# EAGLE design Controller-Modul_v1 (EAGLE 8.5.0)
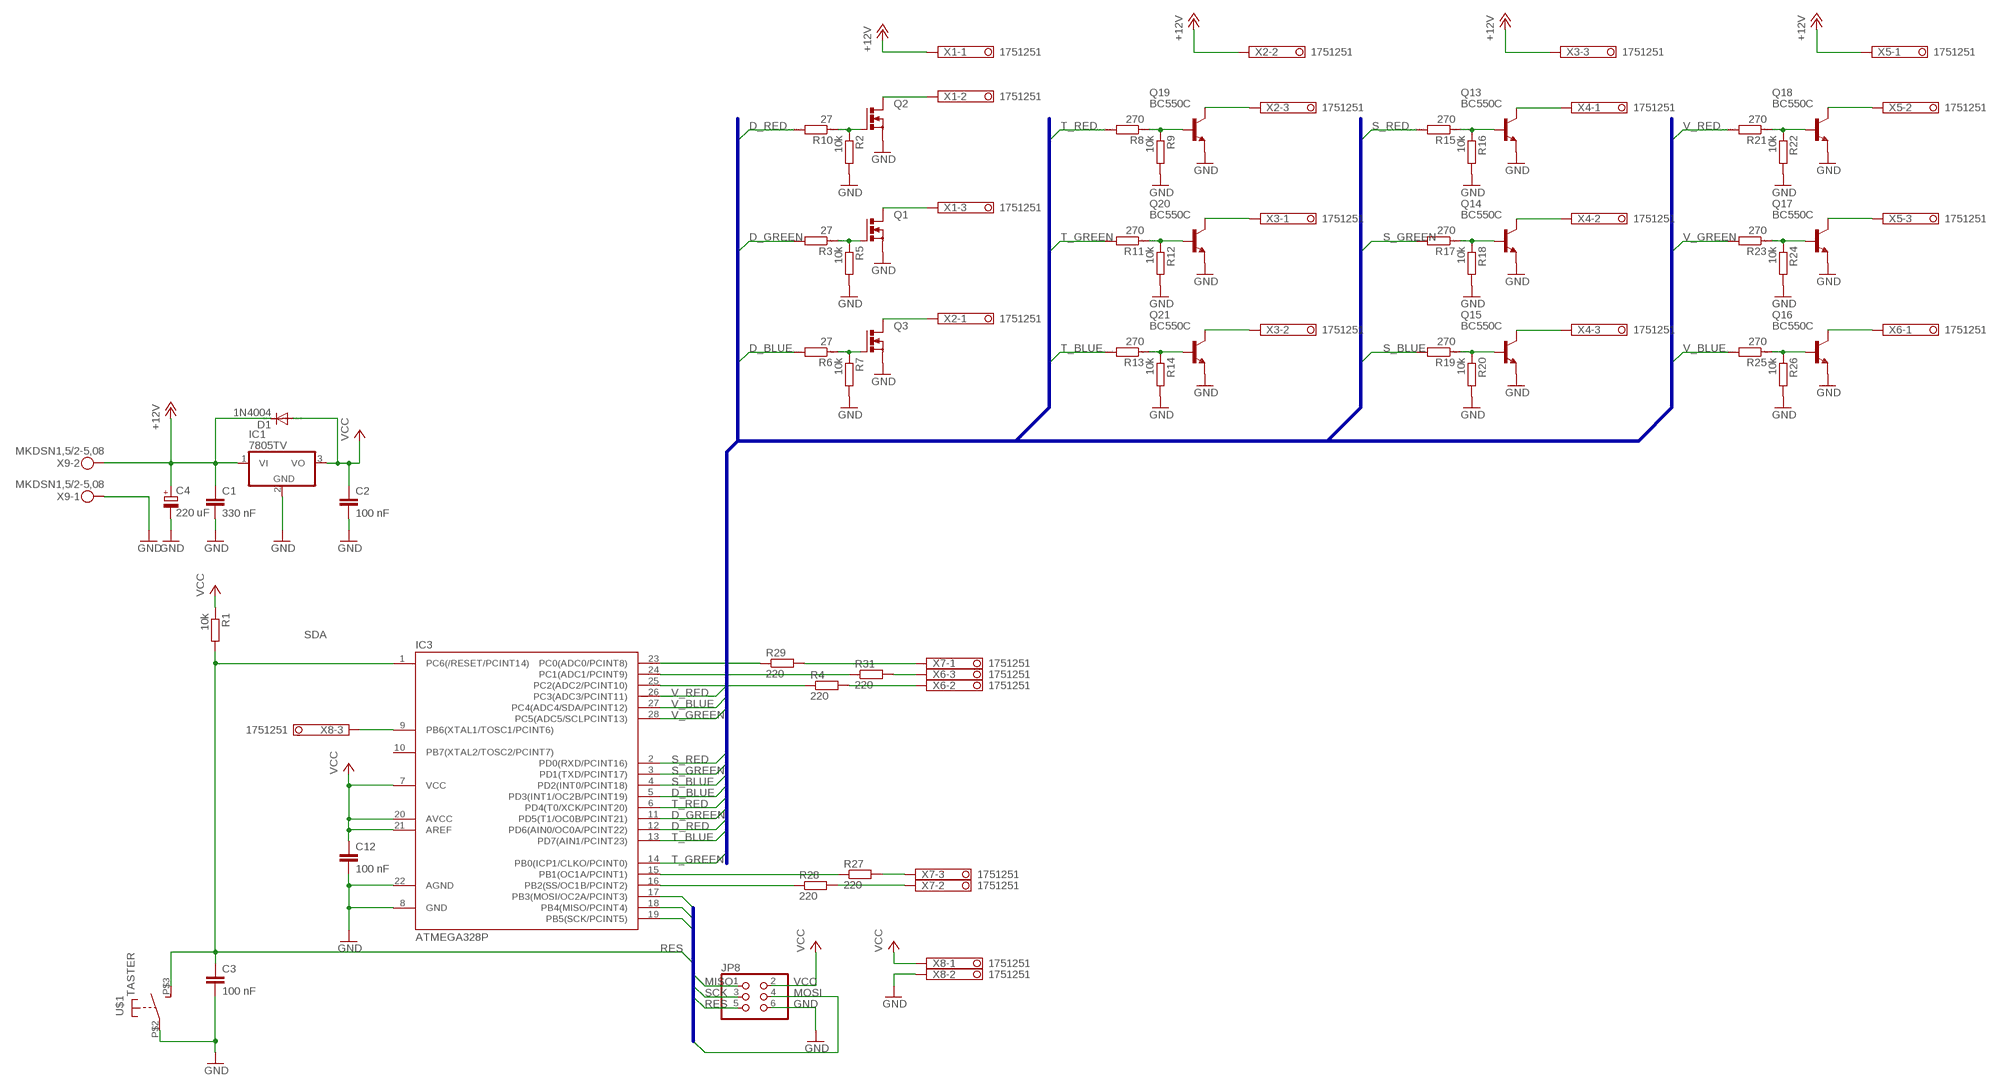
[diagram p0: schematic, sheet 1]

## Parts
C1  330 nF  C-EUC1206  [C1206]
C2  100 nF  C-EUC0603  [C0603]
C3  100 nF  C-EUC0603  [C0603]
C4  220 uF  CPOL-EUE3.5-8  [E3,5-8]
C12  100 nF  C-EUC0603  [C0603]
D1  1N4004  [DO41-10]
IC1  7805TV  [TO220V]
IC3  ATMEGA328P  MEGA48/88/168-PU  [DIL28-3]
JP8  PINHD-2X3  [2X03]
Q1  PMOSFET_NTO220BV  [TO220BV]
Q2  PMOSFET_NTO220BV  [TO220BV]
Q3  PMOSFET_NTO220BV  [TO220BV]
Q13  BC550C  [TO92-EBC]
Q14  BC550C  [TO92-EBC]
Q15  BC550C  [TO92-EBC]
Q16  BC550C  [TO92-EBC]
Q17  BC550C  [TO92-EBC]
Q18  BC550C  [TO92-EBC]
Q19  BC550C  [TO92-EBC]
Q20  BC550C  [TO92-EBC]
Q21  BC550C  [TO92-EBC]
R1  10k  R-EU_R1206  [R1206]
R2  10k  R-EU_R1206  [R1206]
R3  27  RR1206  [R1206]
R4  220  R-EU_R1206  [R1206]
R5  10k  R-EU_R1206  [R1206]
R6  27  RR1206  [R1206]
R7  10k  R-EU_R1206  [R1206]
R8  270  RR1206  [R1206]
R9  10k  R-EU_R1206  [R1206]
R10  27  RR1206  [R1206]
R11  270  RR1206  [R1206]
R12  10k  R-EU_R1206  [R1206]
R13  270  RR1206  [R1206]
R14  10k  R-EU_R1206  [R1206]
R15  270  RR1206  [R1206]
R16  10k  R-EU_R1206  [R1206]
R17  270  RR1206  [R1206]
R18  10k  R-EU_R1206  [R1206]
R19  270  RR1206  [R1206]
R20  10k  R-EU_R1206  [R1206]
R21  270  RR1206  [R1206]
R22  10k  R-EU_R1206  [R1206]
R23  270  RR1206  [R1206]
R24  10k  R-EU_R1206  [R1206]
R25  270  RR1206  [R1206]
R26  10k  R-EU_R1206  [R1206]
R27  220  R-EU_R1206  [R1206]
R28  220  R-EU_R1206  [R1206]
R29  220  R-EU_R1206  [R1206]
R31  220  R-EU_R1206  [R1206]
U$1  TASTER  [NAMAE-JTP-1130]
X1  1751251  [1751251]
X2  1751251  [1751251]
X3  1751251  [1751251]
X4  1751251  [1751251]
X5  1751251  [1751251]
X6  1751251  [1751251]
X7  1751251  [1751251]
X8  1751251  [1751251]
X9  MKDSN1,5/2-5,08  [MKDSN1,5/2-5,08]

## Nets
+12V: C1.1 C4.+ D1.C IC1.1(VI) X1.1 X2.2 X3.3 X5.1 X9.2
D_BLUE: IC3.5(PD3(INT1/OC2B/PCINT19)) R6.2
D_GREEN: IC3.11(PD5(T1/OC0B/PCINT21)) R3.2
D_RED: IC3.12(PD6(AIN0/OC0A/PCINT22)) R10.2
GND: C1.2 C2.2 C3.2 C4.- C12.2 IC1.2(GND) IC3.8(GND) IC3.22(AGND) JP8.6 Q1.S Q2.S Q3.S Q13.E Q14.E Q15.E Q16.E Q17.E Q18.E Q19.E Q20.E Q21.E R2.2 R5.2 R7.2 R9.2 R12.2 R14.2 R16.2 R18.2 R20.2 R22.2 R24.2 R26.2 U$1.P$2(P) X8.2 X9.1
MISO: IC3.18(PB4(MISO/PCINT4)) JP8.1
MOSI: IC3.17(PB3(MOSI/OC2A/PCINT3)) JP8.4
N$1: Q1.G R3.1 R5.1
N$2: Q3.G R6.1 R7.1
N$4: IC3.24(PC1(ADC1/PCINT9)) R31.1
N$5: Q19.B R8.1 R9.1
N$6: Q20.B R11.1 R12.1
N$7: Q2.G R2.1 R10.1
N$8: Q21.B R13.1 R14.1
N$9: Q13.B R15.1 R16.1
N$10: Q14.B R17.1 R18.1
N$11: Q15.B R19.1 R20.1
N$12: Q18.B R21.1 R22.1
N$13: Q17.B R23.1 R24.1
N$14: Q16.B R25.1 R26.1
N$15: Q2.D X1.2
N$17: Q19.C X2.3
N$18: Q1.D X1.3
N$19: Q3.D X2.1
N$20: Q20.C X3.1
N$21: Q21.C X3.2
N$22: Q18.C X5.2
N$23: Q17.C X5.3
N$24: Q16.C X6.1
N$25: Q15.C X4.3
N$26: Q14.C X4.2
N$27: Q13.C X4.1
N$28: IC3.25(PC2(ADC2/PCINT10)) R4.1
N$29: IC3.23(PC0(ADC0/PCINT8)) R29.1
N$30: IC3.15(PB1(OC1A/PCINT1)) R27.1
N$31: IC3.16(PB2(SS/OC1B/PCINT2)) R28.1
N$32: R31.2 X6.3
N$33: R4.2 X6.2
N$34: R27.2 X7.3
N$35: R29.2 X7.1
N$36: R28.2 X7.2
N$38: IC3.9(PB6(XTAL1/TOSC1/PCINT6)) X8.3
RES: C3.1 IC3.1(PC6(/RESET/PCINT14)) JP8.5 R1.2 U$1.P$3(S)
S_BLUE: IC3.4(PD2(INT0/PCINT18)) R19.2
S_GREEN: IC3.3(PD1(TXD/PCINT17)) R17.2
S_RED: IC3.2(PD0(RXD/PCINT16)) R15.2
SCK: IC3.19(PB5(SCK/PCINT5)) JP8.3
T_BLUE: IC3.13(PD7(AIN1/PCINT23)) R13.2
T_GREEN: IC3.14(PB0(ICP1/CLKO/PCINT0)) R11.2
T_RED: IC3.6(PD4(T0/XCK/PCINT20)) R8.2
V_BLUE: IC3.27(PC4(ADC4/SDA/PCINT12)) R25.2
V_GREEN: IC3.28(PC5(ADC5/SCLPCINT13)) R23.2
V_RED: IC3.26(PC3(ADC3/PCINT11)) R21.2
VCC: C2.1 C12.1 D1.A IC1.3(VO) IC3.7(VCC) IC3.20(AVCC) IC3.21(AREF) JP8.2 R1.1 X8.1
Unconnected: IC3.10(PB7(XTAL2/TOSC2/PCINT7))

## Buses
ISP:MISO,MOSI,SCK,RES
LED:D_RED,D_GREEN,D_BLUE,T_RED,T_GREEN,T_BLUE,S_RED,S_GREEN,S_BLUE,V_RED,V_GREEN,V_BLUE

## Notes on the sheet
- SDA

## Library data of the parts
C1-C3 C12 = resistor:C-EU: CAPACITOR, European symbol
C4 = rcl:CPOL-EU: POLARIZED CAPACITOR, European symbol
D1 = diode:1N4004: DIODE general purpose rectifier, 1 A
IC1 = linear:78*: Positive VOLTAGE REGULATOR Source: http://cache.national.com/ds/LM/LM78L05.pdf http://www.fairchildsemi.com/ds/LM/LM7805.pdf
IC3 = avr-6:MEGA48/88/168-PU
JP8 = pinhead:PINHD-2X3: PIN HEADER
Q1-Q3 = transistor-power:PMOSFET_N: Power MOSFET N-Channel
Q13-Q21 = transistor-npn:BC550*: NPN Transistor
R1 R2 R4 R5 R7 R9 R12 R14 R16 R18 R20 R22 R24 R26-R29 R31 = resistor:R-EU_: RESISTOR, European symbol
R3 R6 R8 R10 R11 R13 R15 R17 R19 R21 R23 R25 = eagle-ltspice:R: RESISTOR, European symbol; SPICEMODEL: NONE; SPICEPREFIX: R
U$1 = 0liver:TASTER
X1-X8 = con-phoenix-350:1751251: MKDS 1/ 3-3,5 Printklemme Nennstrom: 10 A Bemessungsspannung: 160 V Raster: 3,5 mm Polzahl: 3 Montageart: Löten Anschlussart: Schraubanschluss Anschlussrichtung vom Leiter zur Platine: 0° Source: http://eshop.phoenixcontact.com .. 1751251.pdf; OC_FARNELL: unknown; OC_NEWARK: unknown
X9 = con-phoenix-508:MKDSN1,5/2-5,08: MKDSN 1,5/ 2-5,08 Printklemme Nennstrom: 13,5 A Nennspannung: 250 V Rastermaß: 5,08 mm Polzahl: 2 Anschlussart: Schraubanschluss Montage: Löten Anschlussrichtung Leiter/Platine: 0 ° Artikelnummer: 1729128 Source: http://eshop.phoenixcontact.com .. 1729128.pdf

## Board
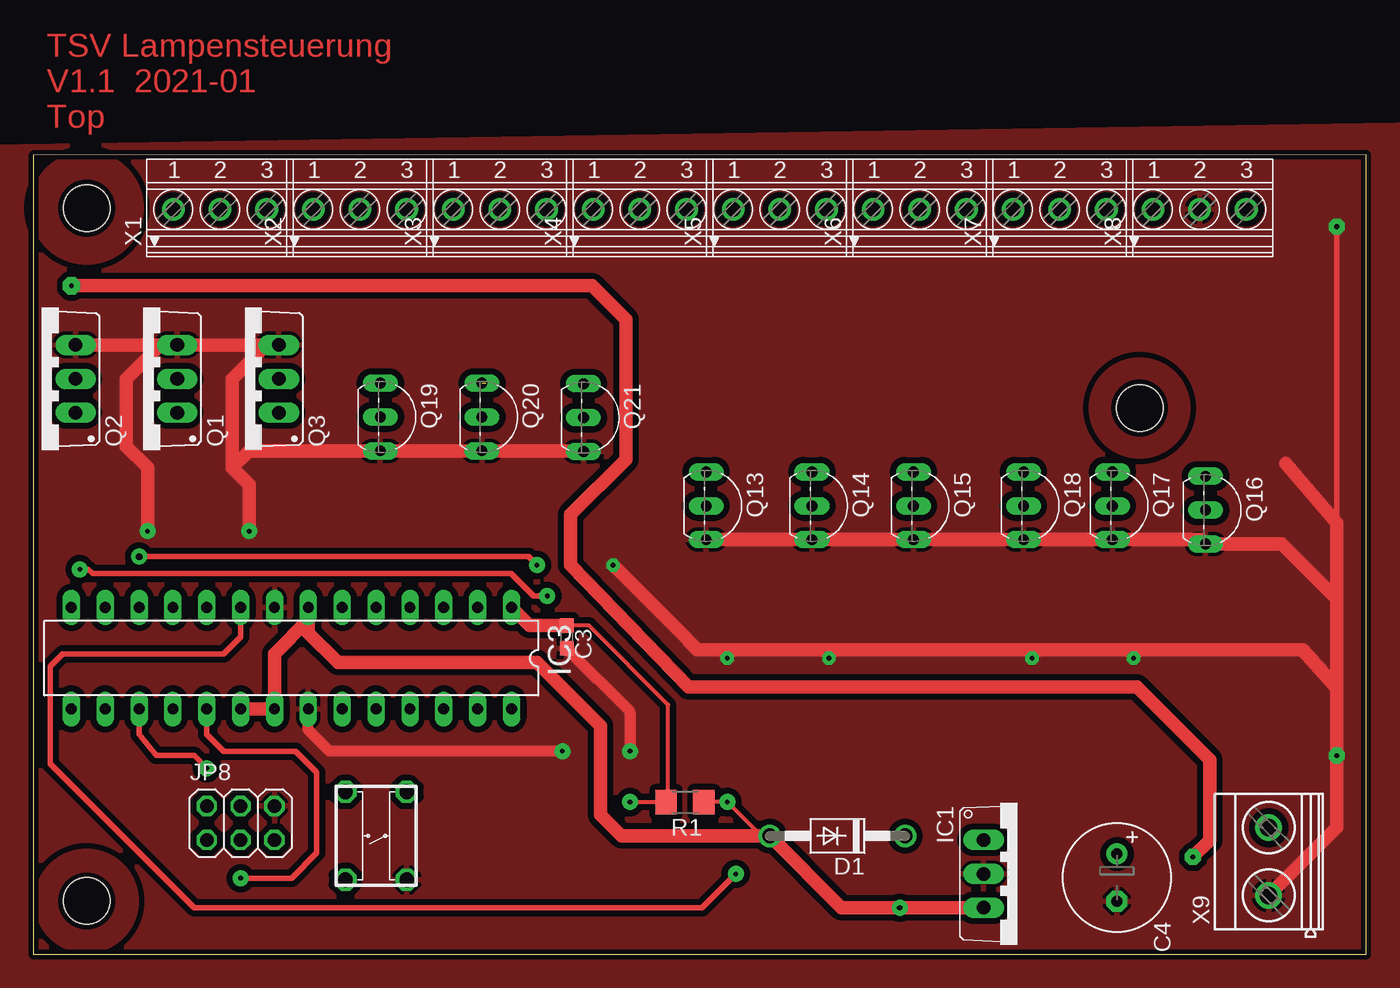
[diagram p1: board, top side]
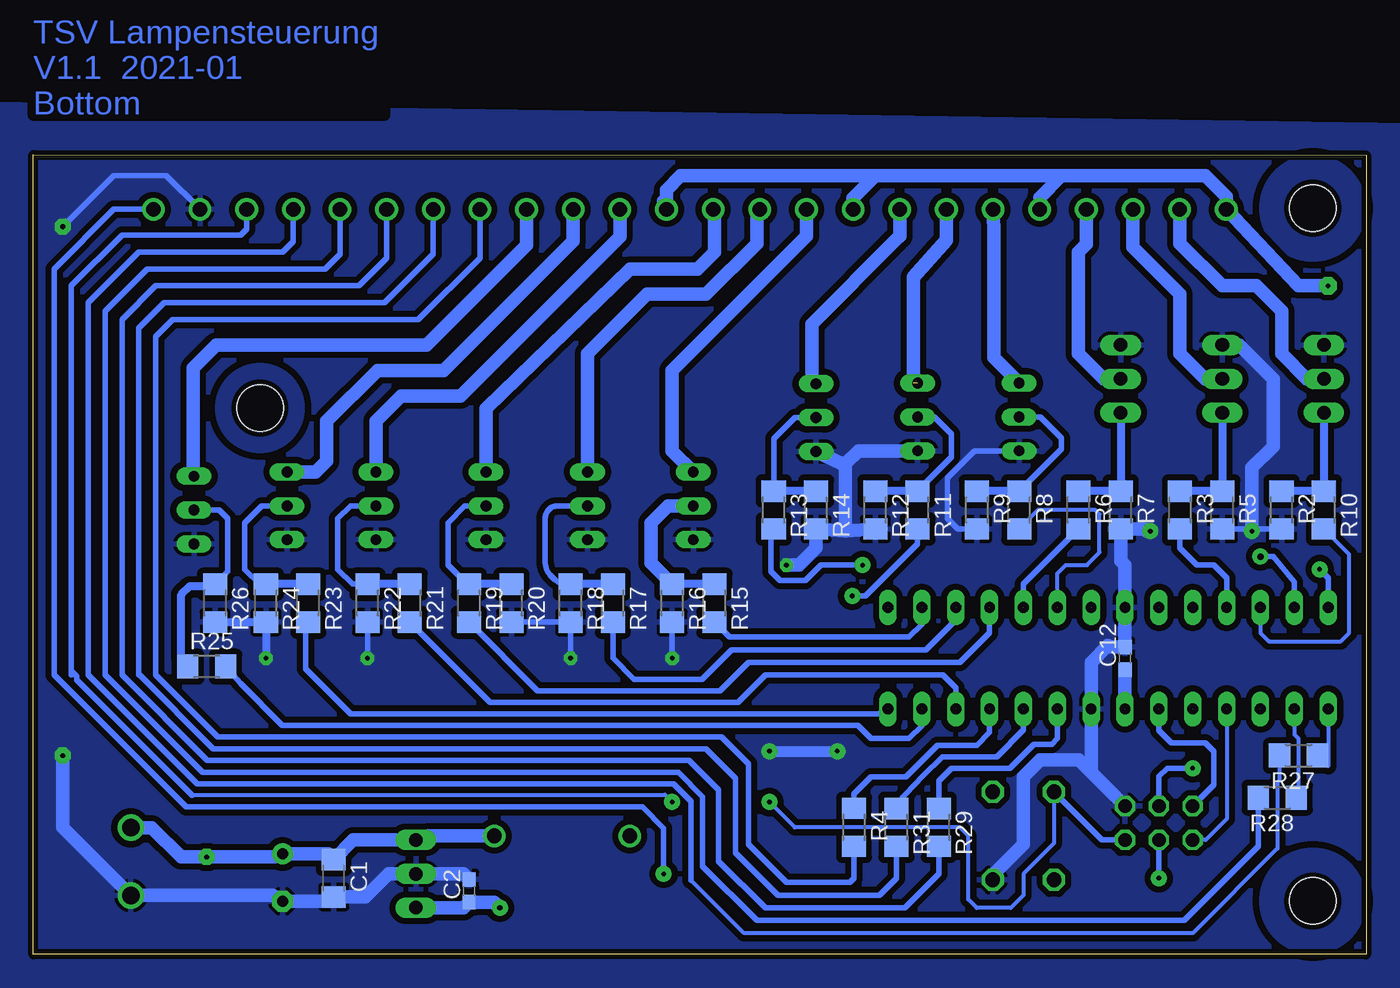
[diagram p2: board, bottom side, seen from below]

Size 100 x 60 mm. Coordinates in mm from the lower left corner, seen from the top.
Outline: 0,0 100,0 100,60 0,59.95 0,0
Copper layers (1*16): Top 0.035mm / dielectric 1.5mm / Bottom 0.035mm
Design rules "default *": minimum track width 10mil, minimum drill 24mil, track to track 18mil, track to pad 18mil, pad to pad 18mil, via to via 18mil, smd to smd 8mil, copper to edge 15mil, drill to drill 8mil, minimum pad ring 10mil, minimum via ring 8mil, stop-mask expansion 4mil, vias tented up to drill 0mil, thermal gap 10mil
Holes 3.5 mm at 4,56 4,4 83,41
tRestrict: area 79,37 to 87,45; area -0.5,51.5 to 8.5,60.5; area -0.1,-0.1 to 8.1,8.1
bRestrict: area -0.2,-0.2 to 8.2,8.2; area -0.2,51.8 to 8.2,60.2; area 79.4,37.4 to 86.6,44.6

### Footprints (pad centres in the part's own frame; a part is rotated, then mirrored left to right if it is on the bottom)
C1206 = smd 1.6 x 1.8: 1 -1.4,0; 2 1.4,0
C0603 = smd 1.1 x 1: 1 -0.85,0; 2 0.85,0
E3,5-8 = drill 0.813 pad 1.6: + -1.778,0 | drill 0.813 pad 1.6 octagon: - 1.778,0
DO41-10 = drill 1.118: A 5.08,0; C -5.08,0
TO220V = drill 1.016 long: 1 -2.54,-2.54; 2 0,-2.54; 3 2.54,-2.54
DIL28-3 = drill 0.813 long: 1 -16.51,-3.81; 2 -13.97,-3.81; 3 -11.43,-3.81; 4 -8.89,-3.81; 5 -6.35,-3.81; 6 -3.81,-3.81; 7 -1.27,-3.81; 8 1.27,-3.81; 9 3.81,-3.81; 10 6.35,-3.81; 11 8.89,-3.81; 12 11.43,-3.81; 13 13.97,-3.81; 14 16.51,-3.81; 15 16.51,3.81; 16 13.97,3.81; 17 11.43,3.81; 18 8.89,3.81; 19 6.35,3.81; 20 3.81,3.81; 21 1.27,3.81; 22 -1.27,3.81; 23 -3.81,3.81; 24 -6.35,3.81; 25 -8.89,3.81; 26 -11.43,3.81; 27 -13.97,3.81; 28 -16.51,3.81
2X03 = drill 1.016 octagon: 1 -2.54,-1.27; 2 -2.54,1.27; 3 0,-1.27; 4 0,1.27; 5 2.54,-1.27; 6 2.54,1.27
TO220BV = drill 1.016 long: D 0,-2.54; G -2.54,-2.54; S 2.54,-2.54
TO92-EBC = drill 0.813 long: B 0,-1.27; C -2.54,-1.27; E 2.54,-1.27
R1206 = smd 1.6 x 1.803: 1 -1.422,0; 2 1.422,0
NAMAE-JTP-1130 = drill 1.1 octagon: P$1 3.3,-2.3; P$2 -3.3,-2.3; P$3 3.3,2.3; P$4 -3.3,2.3
1751251 = drill 1.1 pad 1.7: 1 -3.5,-0.1; 2 0,-0.1; 3 3.5,-0.1
MKDSN1,5/2-5,08 = drill 1.3 pad 2: 1 -2.561,0.025; 2 2.519,0.025

### Placement (x,y rotation side)
C1  77.47,5.71 270 bottom
C2  67.3,4.77 90 bottom
C3  40.01,23.82 270 top
C4  81.3,5.76 270 top
C12  18.1,22.21 90 bottom
D1  60.33,8.88 180 top
IC1  73.83,6.04 270 top
IC3  19.36,22.22 180 top
JP8  15.55,9.86 0 top
Q1  8.26,43.18 90 top
Q2  0.64,43.18 90 top
Q3  15.88,43.18 90 top
Q13  51.75,33.66 270 top
Q14  59.69,33.66 270 top
Q15  67.31,33.66 270 top
Q16  89.22,33.34 270 top
Q17  82.23,33.66 270 top
Q18  75.56,33.66 270 top
Q19  27.3,40.32 270 top
Q20  34.92,40.32 270 top
Q21  42.55,40.27 270 top
R1  48.89,11.43 180 top
R2  6.35,33.34 270 bottom
R3  13.97,33.34 270 bottom
R4  38.42,9.53 270 bottom
R5  10.79,33.34 270 bottom
R6  21.59,33.34 270 bottom
R7  18.41,33.34 270 bottom
R8  26.04,33.34 270 bottom
R9  29.21,33.34 270 bottom
R10  3.17,33.34 270 bottom
R11  33.66,33.34 270 bottom
R12  36.83,33.34 270 bottom
R13  44.45,33.34 270 bottom
R14  41.27,33.34 270 bottom
R15  48.9,26.35 270 bottom
R16  52.07,26.35 270 bottom
R17  56.52,26.35 270 bottom
R18  59.69,26.35 270 bottom
R19  67.31,26.35 270 bottom
R20  64.14,26.35 270 bottom
R21  71.75,26.35 270 bottom
R22  74.93,26.35 270 bottom
R23  79.38,26.35 270 bottom
R24  82.55,26.35 270 bottom
R25  87,21.59 0 bottom
R26  86.36,26.35 270 bottom
R27  5.08,14.92 180 bottom
R28  6.67,11.75 180 bottom
R29  32.07,9.53 270 bottom
R31  35.24,9.53 270 bottom
U$1  25.72,8.89 90 top
X1  14,56 0 top
X2  24.5,56 0 top
X3  35,56 0 top
X4  45.5,56 0 top
X5  56,56 0 top
X6  66.5,56 0 top
X7  77,56 0 top
X8  87.5,56 0 top
X9  92.71,6.99 90 top

### Tracks (layer width: path | path; a pad name or v marks a point on that pad's centre or on a via)
+12V  (via drill 0.35 pad 1.2, 0.35 pad 1.3)
  Top 1.016: v2.86,50.16 4.76,50.16 6.35,50.16 41.91,50.16 44.45,47.62 44.45,37.15 40.32,33.02 40.32,29.21 49.16,20.06 50.48,20.06 82.81,20.06 88.27,14.61 88.27,8.57 v87,7.3
  Bottom 1.016: 22.86,58.42 36.83,58.42 | X2.2 24.5,56.78 22.86,58.42 | X3.3 38.5,56.75 36.83,58.42 | 52.7,56.52 52.5,56.31 X5.1 52.5,57.35 51.44,58.42 36.83,58.42 | 22.86,58.42 12.06,58.42 10.5,56.85 X1.1 5.08,50.16 v2.86,50.16 | X9.2 91.1,9.5 88.9,7.3 v87,7.3 81.85,7.3 C4.+ 77.9,7.54 C1.1 76,8.58 IC1.1 70.37,8.88 D1.C
D_BLUE  (1 unrouted)
  Bottom 0.406: R6.2 25.71,27.79 IC3.5
D_GREEN  (1 unrouted)
  Bottom 0.406: IC3.11 10.47,28.25 11.43,29.21 12.7,29.21 13.97,30.48 R3.2
D_RED  (1 unrouted)
  Bottom 0.305: IC3.12 7.93,24.14 7.94,24.13 7.3,23.5 1.91,23.5 1.27,24.13 1.27,30.01 R10.2
GND  (via drill 0.35 pad 1, 0.35 pad 1.2)
  Top 0.406: v97.79,54.61 97.79,32.38 97.79,31.75 | v52.07,22.23 53.02,22.86 53.34,22.86 | v59.69,22.23 60.33,22.86 | v74.93,22.23 75.88,22.86 76.2,22.86 | v82.55,22.23 83.82,22.86
  Top 0.813: C3.2 44.77,18.21 v44.77,15.24 | v39.69,15.24 22.23,15.24 20.63,16.83 IC3.22
  Top 1.016: 17.46,45.72 Q1.S 9.53,45.72 | 17.46,45.72 Q3.S | 93.98,36.83 97.79,32.38 97.79,26.67 | 9.53,45.72 Q2.S | v43.5,29.21 48.26,24.45 48.42,24.29 49.85,22.86 53.34,22.86 60.33,22.86 76.2,22.86 83.82,22.86 95.25,22.86 97.79,20 | 97.79,20 v97.79,14.92 97.79,9.53 X9.1 | 97.79,26.67 97.79,20 | v16.19,31.75 16.19,35.24 14.92,36.51 | 14.92,36.51 14.92,43.18 17.46,45.72 | v8.57,31.75 8.57,36.51 6.99,38.1 6.99,43.18 9.53,45.72 | 14.92,36.51 16.19,37.78 Q19.E Q20.E 40.32,37.78 Q21.E | Q13.E Q14.E Q15.E Q18.E Q17.E 87.63,31.11 Q16.E 93.66,30.8 97.79,26.67
  Bottom 0.406: X8.2 90.02,58.42 93.98,58.42 v97.79,54.61 | R16.2 v52.07,22.23 52.07,21.91 | v59.69,22.23 R18.2 R20.2 | R22.2 v74.93,22.23 | R5.2 8.74,31.92 v8.57,31.75 8.41,31.92 R2.2 | Q19.E 29.41,37.78 31.43,35.76 31.43,32.7 30.64,31.92 R9.2
  Bottom 0.61: R26.2 R24.2 v82.55,22.23
  Bottom 0.813: v44.77,15.24 v39.69,15.24
  Bottom 1.016: Q1.S 9.53,45.72 6.99,43.18 6.99,38.1 8.57,36.51 v8.57,31.75 | 39.05,31.76 39.05,36.83 | R12.2 39.05,31.76 | 39.05,31.76 R14.2 41.27,30.48 42.55,29.21 v43.5,29.21 | v97.79,14.92 97.79,9.53 X9.1 82.05,4.42 C4.- 77.79,3.98 C1.2 75.07,4.31 73.34,6.04 IC1.2 67.72,6.04 C2.2 | v16.19,31.75 16.51,31.75 16.68,31.92 R7.2 18.41,29.53 18.1,29.21 IC3.8 | IC3.8 | IC3.8 C12.2 19.25,23.06 19.37,23.18 20.63,21.91 20.63,13.67 | 20.63,13.67 JP8.6 | U$1.P$2 28.02,5.96 25.72,8.26 25.72,13.34 24.45,14.61 21.57,14.61 20.63,13.67 | 39.05,36.83 39.37,36.83 Q21.E | 39.05,36.83 38.1,37.78 Q20.E
  pour Bottom: -5.4,-3.49 108.01,-2.22 106.38,61.52 -5.26,60.12
  pour Top: -9.53,64.52 111.36,64.52 113.27,-6.99 -7.62,-6.99
MISO  (1 unrouted)
  Bottom 0.305: IC3.18 10.47,10.16 12.05,8.59 JP8.1
MOSI  (via drill 0.35 pad 1.2)  (1 unrouted)
  Top 0.406: IC3.17 7.94,16.51 9.21,14.92 12.06,14.92 v13.02,13.97
  Bottom 0.406: v13.02,13.97 14.92,13.97 15.55,13.34 JP8.4
N$1
  Bottom 0.61: Q1.G R5.1 R3.1
N$2
  Bottom 0.61: Q3.G R7.1 R6.1
N$3
  pour Top: -5.63,60.52 106.96,62.29 106.74,-4.13 -4.13,-4.13
N$4  (1 unrouted)
  Bottom 0.406: IC3.24 25.71,16.83 27.71,14.83 31.79,14.83 33.25,13.38 35.15,11.35 R31.1
N$5
  Bottom 0.406: R8.1 22.86,37.93 22.86,38.73 24.45,40.32 Q19.B
  Bottom 0.61: R8.1 R9.1
N$6
  Bottom 0.406: R11.1 31.11,37.3 31.11,39.05 32.38,40.32 Q20.B
  Bottom 0.61: R11.1 R12.1
N$7
  Bottom 0.61: Q2.G R10.1 R2.1
N$8
  Bottom 0.406: R13.1 44.45,38.69 42.86,40.27 Q21.B
  Bottom 0.61: R14.1 R13.1
N$9
  Bottom 0.61: R15.1 R16.1 52.22,27.77 52.7,28.26
  Bottom 1.016: Q13.B 52.39,33.66 53.66,32.38 53.66,29.36 R16.1
N$10
  Bottom 0.406: Q14.B 60.64,33.66 arc-90 61.59,32.7 61.59,29.53 arc-90 59.84,27.77 R18.1
  Bottom 0.61: R17.1 R18.1
N$11
  Bottom 0.406: Q15.B 67.63,33.66 68.9,32.38 68.9,29.21 67.46,27.77 R19.1
  Bottom 0.61: R20.1 R19.1
N$12
  Bottom 0.406: Q18.B 76.2,33.66 77.15,32.7 77.15,28.89 76.03,27.77 R22.1
  Bottom 0.61: R21.1 R22.1
N$13
  Bottom 0.406: Q17.B 82.87,33.66 84.14,32.38 84.14,28.89 83.02,27.77 R24.1
  Bottom 0.61: R23.1 R24.1
N$14
  Bottom 0.406: Q16.B 86.04,33.34 85.41,32.7 85.41,28.73 86.51,27.62
  Bottom 0.61: R26.1 86.51,27.62 88.27,27.62 88.9,26.99 88.9,22.23 88.42,21.74 R25.1
N$15
  Bottom 1.016: X1.2 13.97,55.87 13.97,53.34 10.79,50.16 8.26,50.16 6.35,48.26 6.35,45.09 4.45,43.18 Q2.D
N$16
  pour Bottom: -8.26,62.11 108.38,63.88 108.38,-4.31 -8.26,-5.08
N$17
  Bottom 1.016: X2.3 28,55.5 27.94,54.61 27.94,44.77 Q19.C
N$18
  Bottom 1.016: X1.3 17.5,53.06 13.97,49.53 13.97,45.09 12.06,43.18 Q1.D
N$19
  Bottom 1.016: X2.1 21,53.3 21.59,52.7 21.59,45.09 19.68,43.18 Q3.D
N$20  (1 unrouted)
  Bottom 1.016: X3.1 31.5,53.59 33.97,50.8 33.97,47.62 33.97,42.86
N$21
  Bottom 1.016: X3.2 35,53.9 35.24,53.66 41.59,47.31 41.59,43.13 Q21.C
N$22
  Bottom 1.016: Q18.C 74.3,40.01 72.39,41.91 67.94,41.91 56,53.85 X5.2
N$23
  Bottom 1.016: X5.3 59.5,53.53 69.22,43.81 74.19,43.81 78,40 78,37 78.81,36.2 Q17.C
N$24
  Bottom 1.016: 88.05,35.98 Q16.C 88,35.93 88,44 86.28,45.72 70.48,45.72 63,53.2 X6.1
N$25
  Bottom 1.016: Q15.C 66.04,40.96 55.24,51.44 50.16,51.44 48.9,52.7 48.9,55.8 X4.3
N$26
  Bottom 1.016: X4.2 45.72,55.68 45.72,53.34 49.53,49.53 53.98,49.53 58.42,45.09 58.42,36.51 Q14.C
N$27
  Bottom 1.016: X4.1 42,53.88 52.07,43.81 52.07,37.78 Q13.C
N$28  (1 unrouted)
  Bottom 0.406: IC3.25 28.25,16.66 29.21,15.7 32.16,15.7 34.52,13.34 37.15,13.34 38.42,12.06 R4.1
N$29  (1 unrouted)
  Bottom 0.406: IC3.23 23.18,16.19 23.6,15.77 24.93,15.77 26.73,13.97 31.11,13.97 32.07,13.02 R29.1
N$30  (1 unrouted)
  Bottom 0.305: IC3.15 2.85,14.12 R27.1
N$31  (1 unrouted)
  Bottom 0.305: IC3.16 5.39,16.5 5.08,16.19 5.08,11.91 R28.1
N$32
  Bottom 0.406: X6.3 70,52.55 73.66,48.9 90.17,48.9 92.08,46.99 92.08,20.95 92.03,20.95 86.49,15.42 49.53,15.42 47.31,13.2 47.31,7.62 44.13,4.45 36.51,4.45 35.24,5.71 R31.2
N$33
  Bottom 0.406: X6.2 66.5,52.24 71.12,47.62 89.53,47.62 90.81,46.35 90.81,20.95 86.17,16.32 48.39,16.32 46.35,14.29 46.35,8.26 43.5,5.4 38.73,5.4 38.42,5.71 R4.2
N$34
  Bottom 0.305: R27.2 6.5,13.05 6.66,12.9 6.66,7.95 13.02,1.59 46.67,1.59 50.64,5.56
  Bottom 0.406: X7.3 80.5,53.48 81.28,52.7 92.08,52.7 95.89,48.9 95.89,20.95 87.72,12.79 51.96,12.79 50.64,11.47 50.64,5.56
N$35
  Bottom 0.406: X7.1 73.5,52.23 75.56,50.16 90.81,50.16 93.34,47.62 93.34,20.95 86.94,14.55 50.8,14.55 48.58,12.33 48.58,6.99 45.09,3.49 34.61,3.49 32.07,6.03 R29.2
N$36
  Bottom 0.406: X7.2 77,52.54 78.11,51.44 91.44,51.44 94.61,48.26 94.61,20.95 87.31,13.65 51.6,13.65 49.78,11.83 49.78,6.6 45.72,2.54 13.65,2.54 8.09,8.1 R28.2
N$38  (via drill 0.35 pad 1.2)  (1 unrouted)
  Top 0.406: IC3.9 15.55,23.81 14.29,22.54 2.22,22.54 1.27,21.59 1.27,14.29 12.06,3.49 50.16,3.49 v52.7,6.03
  Bottom 0.406: X8.3 93.96,55.9 98.42,51.44 98.42,20.95 88.53,11.06 54.29,11.06 52.7,9.47 v52.7,6.03
RES  (via drill 0.35 pad 1.2)  (1 unrouted)
  Top 0.305: C3.1 41.69,24.67 47.62,18.73 47.62,11.75 47.47,11.59 R1.2 v44.77,11.43
  Top 1.016: IC3.1 37.23,24.67 C3.1
  Bottom 0.305: U$1.P$3 23.42,8.33 25.72,6.03 25.72,4.45 26.67,3.49 29.21,3.49 29.84,4.13 29.84,8.89 30.48,9.53 42.86,9.53 v44.77,11.43
  Bottom 0.406: JP8.5 19.82,8.59 U$1.P$3
S_BLUE  (1 unrouted)
  Bottom 0.406: R19.2 62.15,19.77 48.49,19.77 46.35,21.91 30.48,21.91 28.25,24.14 IC3.4
S_GREEN  (1 unrouted)
  Bottom 0.406: R17.2 56.52,22.23 54.93,20.64 49.85,20.64 47.62,22.86 33.02,22.86 30.79,25.09 IC3.3
S_RED  (1 unrouted)
  Bottom 0.406: IC3.2 33.34,24.77 34.29,23.81 46.99,23.81 47.78,23.81 R15.2
SCK  (via drill 0.35 pad 1.2)  (1 unrouted)
  Top 0.406: IC3.19 13.01,16.52 14.29,15.24 19.68,15.24 21.27,13.65 21.27,7.62 19.37,5.71 v15.56,5.71
  Bottom 0.406: v15.56,5.71 v15.55,5.72 JP8.3
T_BLUE  (via drill 0.35 pad 1.2, 0.5 pad 1.2)  (1 unrouted)
  Top 0.406: v7.94,29.84 37.15,29.84 v37.78,29.21
  Bottom 0.406: IC3.13 5.4,27.94 6.99,29.84 v7.94,29.84 | 40.89,29.21 42.06,28.04 | 42.06,28.04 42.23,28.04 | 42.23,28.04 43.98,28.04 44.67,28.73 44.67,31.33 44.77,31.43 44.45,31.75 R13.2 | v37.78,29.21 40.89,29.21 | 40.89,29.21 42.06,28.04 | 42.06,28.04 42.23,28.04
T_GREEN  (via drill 0.35 pad 1.2)  (1 unrouted)
  Top 0.406: v3.49,28.89 4.13,28.89 4.45,28.57 35.85,28.57 37.54,26.89 v38.56,26.89
  Bottom 0.406: IC3.14 2.85,28.25 v3.49,28.89 | 33.66,31.11 R11.2 33.66,30.8 37.56,26.89 v38.56,26.89 37.68,26.89
T_RED  (1 unrouted)
  Bottom 0.305: IC3.6 23.17,28.58 22.54,29.21 20.95,29.21 20,30.16 20,33.02 20.32,33.34 24.61,33.34 R8.2
V_BLUE  (1 unrouted)
  Bottom 0.406: R25.2 84.46,20.32 81.32,17.18 38.14,17.18 37.15,16.19 34.29,16.19 33.33,17.15 IC3.27
V_GREEN  (1 unrouted)
  Bottom 0.406: R23.2 79.58,24.82 79.58,21.43 76.2,18.05 36.56,18.05 36.2,18.41 IC3.28
V_RED  (1 unrouted)
  Bottom 0.406: R21.2 65.73,18.91 47.13,18.91 45.09,20.95 31.75,20.95 30.8,20 IC3.26
VCC  (via drill 0.35 pad 1.2, 0.4 pad 1.2)  (5 unrouted)
  Top 0.305: D1.A 54.62,8.88 v52.07,11.43 50.03,11.43 R1.1
  Top 1.016: 70.71,3.5 IC1.3 70.71,3.5 | IC3.7 20.63,25.08 | IC3.21 18.09,22.54 20.63,25.08 | IC3.21 | IC3.21 IC3.20 | 20.63,25.08 20.63,24.14 22.86,21.91 37.78,21.91 42.55,17.14 42.55,10.48 44.13,8.89 D1.A 60.64,3.5 v65,3.5 70.71,3.5
  Bottom 0.305: 88.08,11.93 88.03,11.98 52.62,11.98 v52.07,11.43
  Bottom 0.406: X8.1 84,54.43 84.45,53.98 93.34,53.98 97.16,50.16 97.16,21.27 | 97.16,21.27 97.16,20.95 | 97.16,21.27 96.75,20.87 96.75,20.6 88.08,11.93 | IC3.20 15.55,16.82 14.61,15.88 12.06,15.88 11.43,15.24 11.43,12.7 11.44,12.7 JP8.2
  Bottom 1.016: IC1.3 67.72,3.5 C2.1 65.42,3.92 v65,3.5 | C12.1 IC3.21

### Text on the board
Top: TSV Lampensteuerung / V1.1 2021-01 / Top
Bottom: TSV Lampensteuerung / V1.1 2021-01 / Bottom